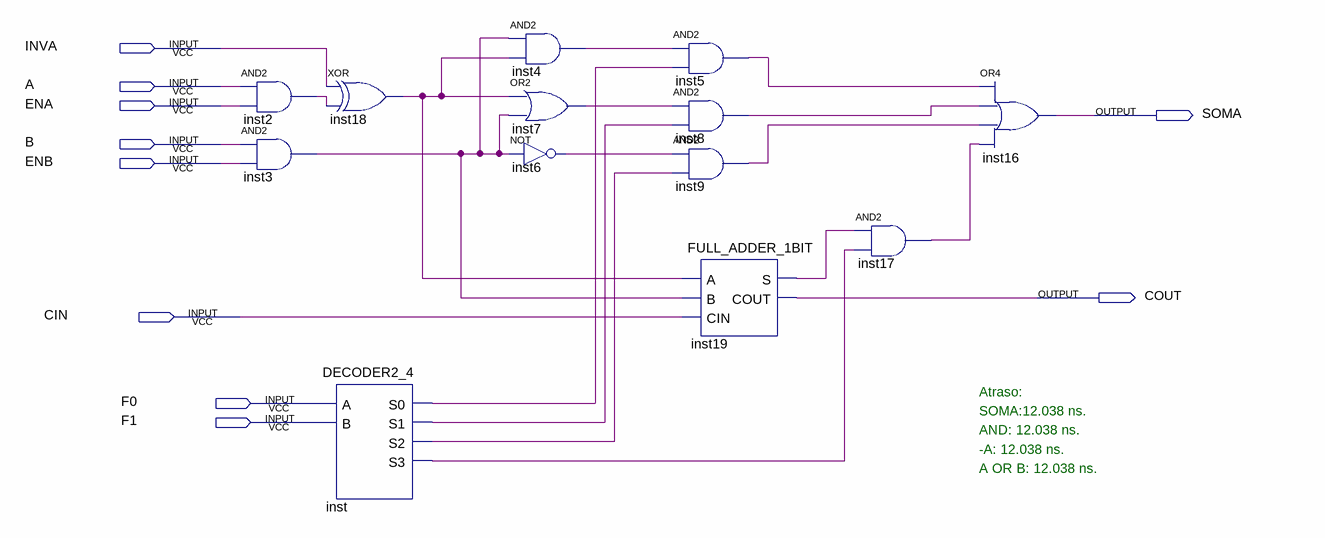
[diagram p0: schematic sheet]
// Quartus schematic ULA_1BIT.bdf as structural Verilog: 13 symbols, 10 pins
module ULA_1BIT (
  input  INVA,
  input  A,
  input  ENA,
  input  B,
  input  ENB,
  input  CIN,
  input  F0,
  input  F1,
  output SOMA,
  output COUT
);

  wire inst2_out, inst3_out, inst4_out, inst5_out, inst6_out, inst7_out, inst8_out, inst9_out, inst17_out,
       inst18_out, inst19_s, inst_s0, inst_s1, inst_s2, inst_s3;

  and inst2 (inst2_out, A, ENA);
  and inst3 (inst3_out, B, ENB);
  xor inst18 (inst18_out, INVA, inst2_out);
  DECODER2_4 inst (.A(F0), .B(F1), .S0(inst_s0), .S1(inst_s1), .S2(inst_s2), .S3(inst_s3));
  and inst4 (inst4_out, inst3_out, inst18_out);
  or inst7 (inst7_out, inst18_out, inst3_out);
  not inst6 (inst6_out, inst3_out);
  and inst5 (inst5_out, inst4_out, inst_s0);
  and inst8 (inst8_out, inst7_out, inst_s1);
  and inst9 (inst9_out, inst6_out, inst_s2);
  FULL_ADDER_1BIT inst19 (.A(inst18_out), .B(inst3_out), .CIN(CIN), .S(inst19_s), .COUT(COUT));
  and inst17 (inst17_out, inst19_s, inst_s3);
  or inst16 (SOMA, inst5_out, inst8_out, inst9_out, inst17_out);

  // Notes on the sheet:
  //   Atraso:
  //   SOMA:12.038 ns.
  //   AND: 12.038 ns.
  //   -A: 12.038 ns.
  //   A OR B: 12.038 ns.
endmodule
